# Altium project murri.PrjPcb
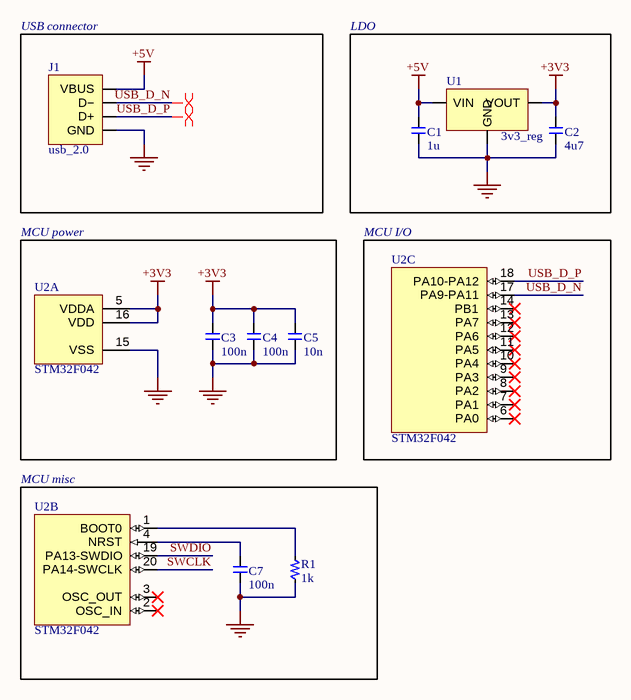
[diagram p0: murri.SchDoc]
PCB_Revision: murri; Project: MURRI; Project_revision: v1.0
1 sheet, 10 parts. Net scope: global (net labels, ports and power ports of the same name join across sheets).
Board file: murri.PcbDoc

## Sheet murri.SchDoc
size A4; SheetNumber: 1; SheetTotal: 1

### Parts
C1  1u  [C0402]
C2  4u7  [C0402]
C3  100n  [C0402]
C4  100n  [C0402]
C5  10n  [C0402]
C7  100n  [C0402]
J1  usb_2.0  [USB_20]  (no BOM)
R1  1k  [R0402]
U1  3v3_reg  [SOT23_torex]
U2  STM32F042  [TSSOP20_ST]  (parts A,B,C of 3)

### Blocks framed on the sheet
USB connector: J1
LDO: C1 C2 U1
MCU power: C3-C5 U2
MCU I/O: U2
MCU misc: C7 R1 U2

### Nets
+3V3: C2.2 C3.2 C4.2 C5.2 U1.2(VOUT) U2.5(VDDA) U2.16(VDD)
+5V: C1.2 J1.1(VBUS) U1.3(VIN)
GND: C1.1 C2.1 C3.1 C4.1 C5.1 C7.1 J1.4(GND) R1.1 U1.1(GND) U2.15(VSS)
SWCLK: U2.20(PA14-SWCLK)
SWDIO: U2.19(PA13-SWDIO)
USB_D_N: J1.2(D−) U2.17(PA9-PA11)
USB_D_P: J1.3(D+) U2.18(PA10-PA12)
NetC7_2: C7.2 U2.4(NRST)
NetR1_2: R1.2 U2.1(BOOT0)

Not connected (* = marked no-connect by the designer): U2 2(OSC_IN)* 3(OSC_OUT)* 6(PA0)* 7(PA1)* 8(PA2)* 9(PA3)* 10(PA4)* 11(PA5)* 12(PA6)* 13(PA7)* 14(PB1)*

### Layout directives
differential pair: USB_D_N, USB_D_P

### Notes on the sheet
- PROJECT
- PCB Revision:
- SIZE
- FILE NAME
- SHEET
- DATE
- A4

### Library data of the parts
C1-C5 C7 = C_0402: 0402 cap
  C1: LCSC: C52923
  C2: LCSC: C23733
  C3 C4 C7: LCSC: C1525
  C5: LCSC: C15195
J1 = USB_20: USB 2.0 PCB
R1 = R_0402: 0402 62.5mW; LCSC: C11702
U1 = XC6206P332MR-G: 200mA Fixed 3.3V Positive electrode 6V SOT-23-3L Voltage Regulators - Linear, Low Drop Out (LDO) Regulators ROHS; LCSC: C5446
U2 = STM32F042F6P6TR: 32KB 1.65V~3.6V ARM-M0 48MHz 16 TSSOP-20(4.4x6.5) Microcontrollers (MCU/MPU/SOC) ROHS; LCSC: C2969989